# Altium schematic sheet Cartridge PCB.SchDoc: Cartridge PCB
size A4; Engineer: Coen de Boer; Revision: 0.5 2118-G
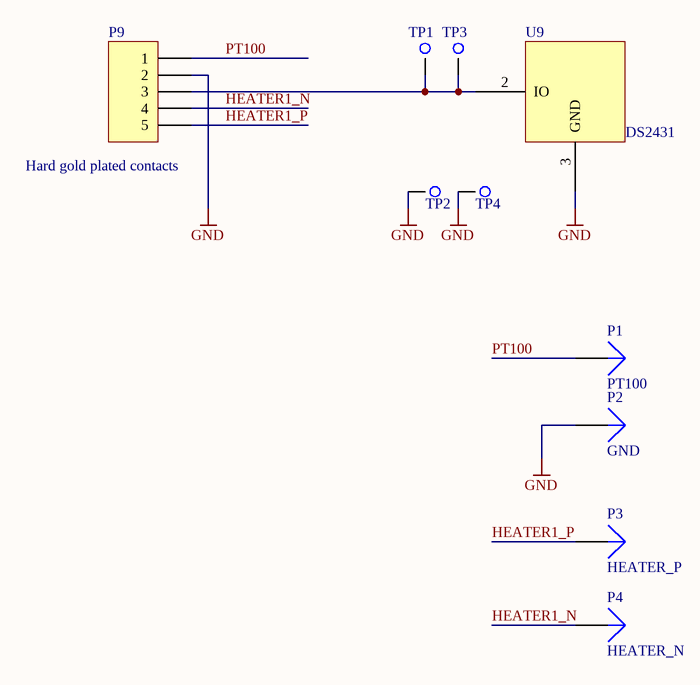
[diagram p0: Cartridge PCB.SchDoc]

## Parts
P1  PT100  [AVX POKE HOME CONTACT 2MM]
P2  GND  [AVX POKE HOME CONTACT 2MM]
P3  HEATER_P  [AVX POKE HOME CONTACT 2MM]
P4  HEATER_N  [AVX POKE HOME CONTACT 2MM]
P9  Hard gold plated contacts  [Mating contacts]
TP1  2mm  [TESTPOINT 2mm]  (value not drawn)  (no BOM)
TP2  2mm  [TESTPOINT 2mm]  (value not drawn)  (no BOM)
TP3  2mm  [TESTPOINT 2mm]  (value not drawn)  (no BOM)
TP4  2mm  [TESTPOINT 2mm]  (value not drawn)  (no BOM)
U9  DS2431  [TDFN-6]

## Nets
GND: P2.1 P9.2 TP2.1 TP4.1 U9.3(GND)
HEATER1_N: P4.1 P9.4
HEATER1_P: P3.1 P9.5
PT100: P1.1 P9.1
NetP9_3: P9.3 TP1.1 TP3.1 U9.2(IO)

## Notes on the sheet
- Title
- Size:
- Date:
- A4
- Number:
- Time:
- Revision:
- Sheet
- of
- File:

## Library data of the parts
P1-P4 = Plug: Mfg: AVX; Mfg code: 70-9296-001-002-006; LatestRevisionDate: 17-Jul-2002; LatestRevisionNote: Re-released for DXP Platform.; Publisher: Altium Limited
P9 = Header 5: Header, 5-Pin; LatestRevisionDate: 17-Jul-2002; LatestRevisionNote: Re-released for DXP Platform.; Publisher: Altium Limited
TP1-TP4 = Testpoint, 2mm, round: Remarks: Not a component; Faber ItemCode: -; Mfg: -; Mfg code: -; Value: -; Supplier: -; Supplier code: -; Max soldering temp: -
U9 = Component_1: Mfg: Maxim; Mfg code: DS2431Q+T&R